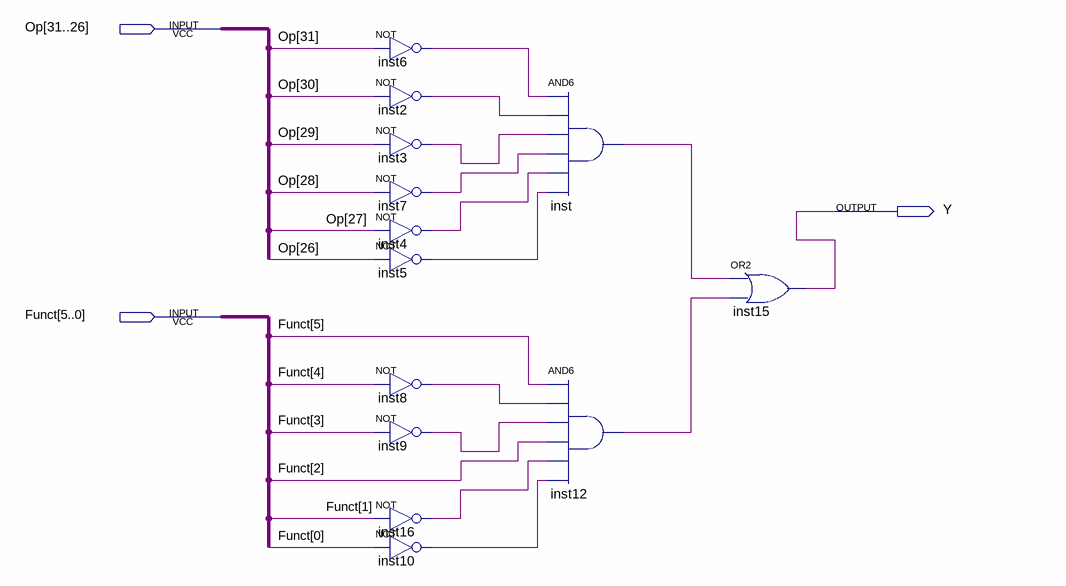
[diagram p0: schematic sheet]
// Quartus schematic AND.bdf as structural Verilog: 13 symbols, 3 pins
module AND (
  input  [31:26] Op,
  input  [5:0] Funct,
  output Y
);

  wire inst2_out, inst3_out, inst4_out, inst5_out, inst6_out, inst7_out, inst8_out, inst9_out, inst10_out,
       inst12_out, inst16_out, inst_out;

  not inst6 (inst6_out, Op[31]);
  not inst2 (inst2_out, Op[30]);
  not inst3 (inst3_out, Op[29]);
  not inst7 (inst7_out, Op[28]);
  not inst4 (inst4_out, Op[27]);
  not inst5 (inst5_out, Op[26]);
  not inst8 (inst8_out, Funct[4]);
  not inst9 (inst9_out, Funct[3]);
  not inst16 (inst16_out, Funct[1]);
  not inst10 (inst10_out, Funct[0]);
  and inst (inst_out, inst6_out, inst2_out, inst3_out, inst7_out, inst4_out, inst5_out);
  and inst12 (inst12_out, Funct[5], inst8_out, inst9_out, Funct[2], inst16_out, inst10_out);
  or inst15 (Y, inst_out, inst12_out);
endmodule
